# Altium schematic sheet CAN.SchDoc
size Letter; Organization: Altium Limited; Address1: L3, 12a Rodborough Rd; Address2: Frenchs Forest; Address3: NSW; Address4: Australia 2086; DocumentNumber: D_13; SheetNumber: 13; SheetTotal: 21
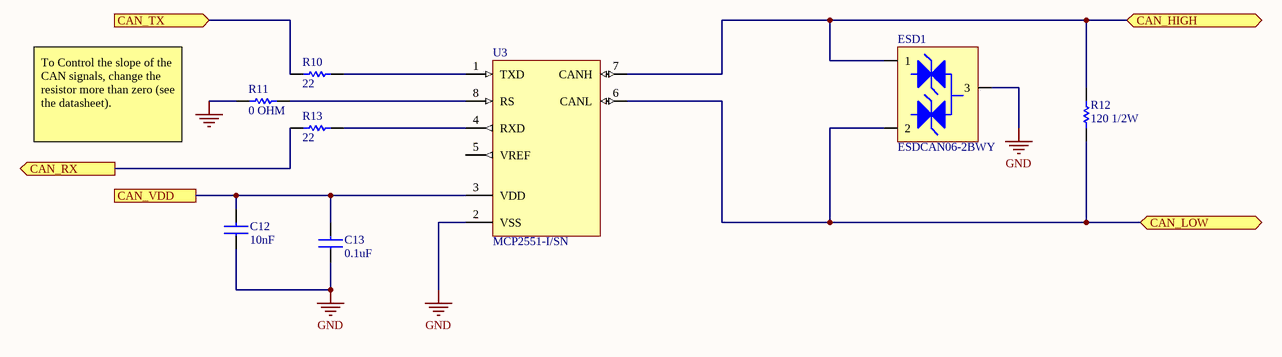
[diagram p0: CAN.SchDoc]

## Parts
C12  10nF  [C0805]
C13  0.1uF  [C0805]
ESD1  ESDCAN06-2BWY  [SOT65P210X110-3N]
R10  22  [R0805]
R11  0 OHM  [R0805]
R12  120 1/2W  [RESC3225X60X45NL20T20]
R13  22  [R0805]
U3  MCP2551-I/SN  [SOIC-SN8_N]

## Ports
CAN_HIGH (bidir), CAN_LOW (bidir), CAN_RX (out), CAN_TX (in), CAN_VDD

## Nets
GND: C12.1 C13.1 ESD1.3 R11.1 U3.2(VSS)
CAN_HIGH: ESD1.1 R12.2 U3.7(CANH) ; port CAN_HIGH
CAN_LOW: ESD1.2 R12.1 U3.6(CANL) ; port CAN_LOW
CAN_RX: R13.1 ; port CAN_RX
CAN_TX: R10.1 ; port CAN_TX
CAN_VDD: C12.2 C13.2 U3.3(VDD) ; port CAN_VDD
NetR10_2: R10.2 U3.1(TXD)
NetR11_2: R11.2 U3.8(RS)
NetR13_2: R13.2 U3.4(RXD)

Not connected (* = marked no-connect by the designer): U3 5(VREF)

## Notes on the sheet
- To Control the slope of the CAN signals, change the resistor more than zero (see the datasheet).
- Title
- Size:
- Date:
- Letter
- Number:
- Time:
- Revision:
- Sheet
- of
- Fluid Power Training
- Institute Inc.
- 2170 S 3040 W
- Salt Lake City, 84119,UT.
- United States.
- File:

## Library data of the parts
C12 = CC0805KRX7R9BB103: YAGEO - CC0805KRX7R9BB103 - SMD Multilayer Ceramic Capacitor, 10000 pF, 50 V, 0805 [2012 Metric], ± 10%, X7R, CC Series; Voltage Rating (DC): 50V; Insulation Resistance: 100GR; Supplier 1: Mouser; Supplier Part Number 1: 603-CC805KRX7R9BB103; Manufacturer: Yageo; Manufacturer Part Number: CC0805KRX7R9BB103; RoHS: Yes; Category: Ceramic Capacitors; Stock 1: 473100; Pricing 1: 1=0.11000, 10=0.05700, 100=0.02600, 1000=0.02100, 4000=0.01600, 8000=0.01400 (USD); Mount: Surface Mount; Case/Package: 0805; Number of Pins: 2; Case Code (Metric): 2012; Case Code (Imperial): 0805; Material: Ceramic; Min Operating Temperature: -55°C; Max Operating Temperature: 125°C; Tolerance: 10%; Capacitance: 10nF; Dielectric: X7R; Packaging: Tape and Reel; Termination: SMD/SMT; Voltage Rating: 50V; Package Quantity: 1; Voltage: 50V; Composition: Ceramic; Length: 2mm; Height: 0.6mm; Width: 1.25mm; Depth: 1.25mm; Thickness: 0.024inch; Radiation Hardening: No; Lead Free: Lead Free; REACH SVHC: No SVHC; Halogen Free: Halogen Free; ComponentLink1URL: https://datasheet.ciiva.com/11786/0900766b80d84f1d-11786119.pdf?src-supplier=RSComponents; ComponentLink1Description: https://datasheet.ciiva.com/11786/0900766b80d84f1d-11786119.pdf?src-supplier=RSComponents; ComponentLink2URL: https://datasheet.ciiva.com/25613/0900766b8027bcf6-25613113.pdf?src-supplier=RSComponents; ComponentLink2Description: https://datasheet.ciiva.com/25613/0900766b8027bcf6-25613113.pdf?src-supplier=RSComponents; ComponentLink3URL: https://datasheet.ciiva.com/144/mlccorderingcode-144533.pdf?src-supplier=Digi-Key; ComponentLink3Description: https://datasheet.ciiva.com/144/mlccorderingcode-144533.pdf?src-supplier=Digi-Key; ComponentLink4URL: https://datasheet.ciiva.com/144/mlccorderingcode-144534.pdf?src-supplier=Digi-Key; ComponentLink4Description: https://datasheet.ciiva.com/144/mlccorderingcode-144534.pdf?src-supplier=Digi-Key; ComponentLink5URL: https://datasheet.ciiva.com/46372/1784427-46372638.pdf?src-supplier=Element14; ComponentLink5Description: https://datasheet.ciiva.com/46372/1784427-46372638.pdf?src-supplier=Element14; ComponentLink6URL: https://datasheet.ciiva.com/144/mlccorderingcode-144532.pdf?src-supplier=Digi-Key; ComponentLink6Description: https://datasheet.ciiva.com/144/mlccorderingcode-144532.pdf?src-supplier=Digi-Key; ComponentLink7URL: https://datasheet.ciiva.com/16625/upy-gphc-x7r-6-3v-to-50v-8-16625548.pdf?src-supplier=Avnet+Europe; ComponentLink7Description: https://datasheet.ciiva.com/16625/upy-gphc-x7r-6-3v-to-50v-8-16625548.pdf?src-supplier=Avnet+Europe; ComponentLink8URL: https://datasheet.ciiva.com/22749/1489800-22749215.pdf?src-supplier=Element14; ComponentLink8Description: https://datasheet.ciiva.com/22749/1489800-22749215.pdf?src-supplier=Element14; ComponentLink9URL: https://datasheet.ciiva.com/46372/1734573-46372639.pdf?src-supplier=Element14; ComponentLink9Description: https://datasheet.ciiva.com/46372/1734573-46372639.pdf?src-supplier=Element14
C13 = C0805C104K5RACTU: Cap Ceramic 0.1uF 50V X7R 10% SMD 2.0 x 1.2 mm 125 C Paper T/R; Manufacturer: KEMET; Capacitance: 100nF; Voltage: 500V; Manufacturer Part Number: C0805C104K5RACTU; RoHS: Yes; Stock 1: 4177670; Pricing 1: 1=0.17000, 10=0.10400, 100=0.05600, 500=0.03900, 1000=0.03200, 4000=0.02400 (USD); Supplier 1: Mouser; Supplier Part Number 1: 80-C0805C104K5R; Category: Ceramic Capacitors; Mount: Surface Mount,PCB; Case/Package: 0805; Number of Pins: 2; Case Code (Imperial): 0805; Case Code (Metric): 2012; Dielectric Material: Ceramic; Contact Plating: Tin,Matte; Min Operating Temperature: -55°C; Max Operating Temperature: 125°C; Voltage Rating: 50V; Tolerance: 10%; Packaging: Tape and Reel; Dielectric: X7R; Package Quantity: 4000; Voltage Rating (DC): 50V; Termination: SMD/SMT; Length: 2mm; Height: 0.9mm; Width: 1.2mm; Depth: 1.25mm; Thickness: 0.035inch; Lead Pitch: 0.75mm; Radiation Hardening: No; REACH SVHC: No SVHC; ComponentLink1URL: https://datasheet.ciiva.com/14589/70095383-14589048.pdf?src-supplier=Allied+Electronics; ComponentLink1Description: https://datasheet.ciiva.com/14589/70095383-14589048.pdf?src-supplier=Allied+Electronics; ComponentLink2URL: https://datasheet.ciiva.com/28682/1851736-28682232.pdf?src-supplier=Element14; ComponentLink2Description: https://datasheet.ciiva.com/28682/1851736-28682232.pdf?src-supplier=Element14; ComponentLink3URL: https://datasheet.ciiva.com/32431/slceramic-chip-condensers-e-32431755.pdf?src-supplier=Distrelec; ComponentLink3Description: https://datasheet.ciiva.com/32431/slceramic-chip-condensers-e-32431755.pdf?src-supplier=Distrelec; ComponentLink4URL: https://datasheet.ciiva.com/18410/70095383-18410815.pdf?src-supplier=Allied+Electronics; ComponentLink4Description: https://datasheet.ciiva.com/18410/70095383-18410815.pdf?src-supplier=Allied+Electronics
ESD1 = ESDCAN06-2BWY: TVS DIODE 35V 59V SOT323-3; Manufacturer: STMicroelectronics; Supplier 1: Mouser; Supplier Part Number 1: 511-ESDCAN06-2BWY; Manufacturer Part Number: ESDCAN06-2BWY; RoHS: No; Category: TVS Diodes; Stock 1: 4203; Pricing 1: 1=0.42000, 10=0.29500, 100=0.13600, 1000=0.10400, 3000=0.08900, 9000=0.08100 (USD); ComponentLink1URL: https://www.st.com/resource/en/datasheet/esdcan06-2bwy.pdf?src-supplier=Digi-Key; ComponentLink1Description: https://www.st.com/resource/en/datasheet/esdcan06-2bwy.pdf?src-supplier=Digi-Key
R10 R13 = CRCW080522R0JNEA: Resistor;  Thick Film;  22 Ohms;  0.125 W;  5%;  SMT;  0805;  TCR 73 ppm/DegC;  Cut Tape; Manufacturer: Vishay Dale; Resistance: 22R; Power Rating: 125mW; Temperature Coefficient: 200ppm/°C; Voltage Rating: 150V; Supplier 1: Mouser; Manufacturer Part Number: CRCW080522R0JNEA; RoHS: Yes; Category: Chip SMD Resistors; Stock 1: 32788; Pricing 1: 1=0.10000, 10=0.03900, 100=0.01500, 1000=0.00600, 5000=0.00400, 10000=0.00400 (USD); Case/Package: 0805; Contact Plating: Tin; Min Operating Temperature: -55°C; Max Operating Temperature: 155°C; Composition: Thick Film; Termination: Solder; Tolerance: 5%; Length: 2mm; Lead Free: Lead Free; ComponentLink1URL: https://datasheet.ciiva.com/28606/1847332-28606766.pdf?src-supplier=Element14; ComponentLink1Description: https://datasheet.ciiva.com/28606/1847332-28606766.pdf?src-supplier=Element14; ComponentLink2URL: https://datasheet.ciiva.com/22871/70201119-22871903.pdf?src-supplier=Allied+Electronics; ComponentLink2Description: https://datasheet.ciiva.com/22871/70201119-22871903.pdf?src-supplier=Allied+Electronics; Supplier Part Number 1: 71-CRCW080522R0JNEA; Weight: 0.000194oz; Case Code (Imperial): 0805; Case Code (Metric): 2012; Packaging: Tape and Reel; Number of Terminations: 2; Max Power Dissipation: 125mW; Package Quantity: 5000; Voltage Rating (DC): 150V; Features: Automotive AEC-Q200; Military Standard: Not; Height: 0.02inch; Width: 1.25mm; Depth: 1.25mm; Radiation Hardening: No; REACH SVHC: Unknown; ComponentLink3URL: https://datasheet.ciiva.com/2464/dcrcwe3-2464258.pdf?src-supplier=Digi-Key; ComponentLink3Description: https://datasheet.ciiva.com/2464/dcrcwe3-2464258.pdf?src-supplier=Digi-Key; ComponentLink4URL: https://datasheet.ciiva.com/16358/dcrcwe3-16358364.pdf?src-supplier=Future+Electronics; ComponentLink4Description: https://datasheet.ciiva.com/16358/dcrcwe3-16358364.pdf?src-supplier=Future+Electronics; ComponentLink5URL: https://datasheet.ciiva.com/16769/70201119-16769711.pdf?src-supplier=Allied+Electronics; ComponentLink5Description: https://datasheet.ciiva.com/16769/70201119-16769711.pdf?src-supplier=Allied+Electronics
R11 = RK73Z2ATTD: Res Thick Film 0805 0 Ohm Pad SMD Automotive T/R; Manufacturer: KOA Speer; Resistance: 0mR; Tolerance: 1%; Power Rating: 2W; Temperature Coefficient: 400ppm/°C; Supplier 1: Mouser; Supplier Part Number 1: 660-RK73Z2ATTD; Manufacturer Part Number: RK73Z2ATTD; RoHS: Yes; Category: Chip SMD Resistors; Stock 1: 381276; Pricing 1: 1=0.10000, 10=0.09500, 100=0.09500, 1000=0.09500, 5000=0.00500, 10000=0.00400 (USD); Case/Package: 0805; Case Code (Imperial): 0805; Case Code (Metric): 2012; Min Operating Temperature: -55°C; Max Operating Temperature: 155°C; Packaging: Tape and Reel; Composition: Thick Film; Package Quantity: 5000; Termination: SMD/SMT; Military Standard: Not; Length: 2mm; Height: 0.5mm; Width: 1.25mm; Depth: 1.25mm; Lead Free: Lead Free; REACH SVHC: Unknown; ComponentLink1URL: https://datasheet.ciiva.com/7816/549012-7816885.pdf?src-supplier=Element14; ComponentLink1Description: https://datasheet.ciiva.com/7816/549012-7816885.pdf?src-supplier=Element14; ComponentLink2URL: https://datasheet.ciiva.com/15159/getdatasheetpartid-91633-15159914.pdf?src-supplier=Verical; ComponentLink2Description: https://datasheet.ciiva.com/15159/getdatasheetpartid-91633-15159914.pdf?src-supplier=Verical; ComponentLink3URL: https://datasheet.ciiva.com/48463/rk73z-series-eng-jap-tds-48463436.pdf?src-supplier=Distrelec; ComponentLink3Description: https://datasheet.ciiva.com/48463/rk73z-series-eng-jap-tds-48463436.pdf?src-supplier=Distrelec
R12 = CRCW1210120RFKEA: Thick Film Resistors - SMD 1/2watt 120ohms 1%; Manufacturer: Vishay; Resistance: 120R; Temperature Coefficient: 100ppm/°C; Power Rating: 500mW; Voltage Rating: 200V; Supplier 1: Mouser; Supplier Part Number 1: 71-CRCW1210F-120-E3; Manufacturer Part Number: CRCW1210120RFKEA; RoHS: Yes; Category: Chip SMD Resistors; Stock 1: 16273; Pricing 1: 1=0.25000, 10=0.21500, 100=0.08400, 1000=0.03200, 5000=0.02600, 10000=0.02400 (USD); Case/Package: 1210; Weight: 0.000564oz; Case Code (Metric): 3225; Case Code (Imperial): 1210; Contact Plating: Tin; Min Operating Temperature: -55°C; Max Operating Temperature: 155°C; Tolerance: 1%; Packaging: Tape and Reel; Package Quantity: 1; Composition: Thick Film; Voltage Rating (DC): 200V; Number of Terminations: 2; Max Power Dissipation: 500mW; Termination: SMD/SMT; Military Standard: Not; Features: Automotive AEC-Q200; Length: 3.2mm; Height: 0.024inch; Width: 0.098inch; Depth: 2.5mm; Radiation Hardening: No; Lead Free: Lead Free; REACH SVHC: Unknown; ComponentLink1URL: https://datasheet.ciiva.com/8899/dcrcwe3-8899640.pdf?src-supplier=Avnet; ComponentLink1Description: https://datasheet.ciiva.com/8899/dcrcwe3-8899640.pdf?src-supplier=Avnet; ComponentLink2URL: https://datasheet.ciiva.com/7777/1697337-7777595.pdf?src-supplier=Element14; ComponentLink2Description: https://datasheet.ciiva.com/7777/1697337-7777595.pdf?src-supplier=Element14; ComponentLink3URL: https://datasheet.ciiva.com/8897/dcrcwe3-8897165.pdf?src-supplier=Avnet; ComponentLink3Description: https://datasheet.ciiva.com/8897/dcrcwe3-8897165.pdf?src-supplier=Avnet; ComponentLink4URL: https://datasheet.ciiva.com/5549/dcrcwe3-109170-5549774.pdf?src-supplier=Mouser; ComponentLink4Description: https://datasheet.ciiva.com/5549/dcrcwe3-109170-5549774.pdf?src-supplier=Mouser
U3 = MCP2551-I/SN: IC TRANSCEIVER CAN HI-SPD 8-SOIC; Manufacturer: Microchip; Operating Supply Voltage: 5V; Data Rate: 1Mbps; Max Supply Voltage: 5.5V; Min Supply Voltage: 4.5V; Number of Transceivers: 1; Nominal Supply Current: 75mA; Slew Rate: 8.5V/µs; Supplier 1: Mouser; Supplier Part Number 1: 579-MCP2551-I/SN; Manufacturer Part Number: MCP2551-I/SN; RoHS: Yes; Category: Interface ICs; Stock 1: 27114; Pricing 1: 1=1.02000, 10=1.02000, 25=0.85000, 100=0.82500, 250=0.82500, 500=0.82500 (USD); Mount: Surface Mount; Case/Package: SOIC; Number of Pins: 8; Contact Plating: Tin,Matte; Number of Terminals: 8; Min Operating Temperature: -40°C; Max Operating Temperature: 85°C; Package Quantity: 100; Interface: CAN; Packaging: Rail/Tube; Max Supply Current: 75mA; Number of Drivers: 1; Number of Receivers: 1; Number of Transmit Buffers: 1; Number of Receive Buffers: 1; Logic Function: Transceiver; Length: 4.9mm; Height: 1.25mm; Width: 3.9mm; Radiation Hardening: No; REACH SVHC: No SVHC; Lead Free: Lead Free; ComponentLink1URL: https://datasheet.ciiva.com/8084/jp011797-8084592.pdf?src-supplier=Avnet; ComponentLink1Description: https://datasheet.ciiva.com/8084/jp011797-8084592.pdf?src-supplier=Avnet; ComponentLink2URL: https://datasheet.ciiva.com/27056/2040583-27056423.pdf?src-supplier=Jameco; ComponentLink2Description: https://datasheet.ciiva.com/27056/2040583-27056423.pdf?src-supplier=Jameco; ComponentLink3URL: https://datasheet.ciiva.com/1495/21667f-1495089.pdf?src-supplier=Element14; ComponentLink3Description: https://datasheet.ciiva.com/1495/21667f-1495089.pdf?src-supplier=Element14; ComponentLink4URL: https://datasheet.ciiva.com/1700/21667f-1700023.pdf?src-supplier=Digi-Key; ComponentLink4Description: https://datasheet.ciiva.com/1700/21667f-1700023.pdf?src-supplier=Digi-Key; ComponentLink5URL: https://datasheet.ciiva.com/14152/eb644223-644224-e-14152540.pdf?src-supplier=Distrelec; ComponentLink5Description: https://datasheet.ciiva.com/14152/eb644223-644224-e-14152540.pdf?src-supplier=Distrelec; ComponentLink6URL: https://datasheet.ciiva.com/17649/jp011797-17649039.pdf?src-supplier=Avnet+Europe; ComponentLink6Description: https://datasheet.ciiva.com/17649/jp011797-17649039.pdf?src-supplier=Avnet+Europe